# EasyEDA Pro project EasyEDApro.epro

# Schematic IR remote esp32-C6
Create Date: 2024-05-06; Page Name: P1; Project Name: Robonomics_IR_Remote_dev_release; Schematic Name: ESP32-C6-MINI-1; Update Date: 2024-05-21; Company: Robonomics.network; Drawed: ludovich88; Page Size: A4; Part Number: IR-ESP32C6-06-24; Reviewed: EnsRationis; Version: V2.2
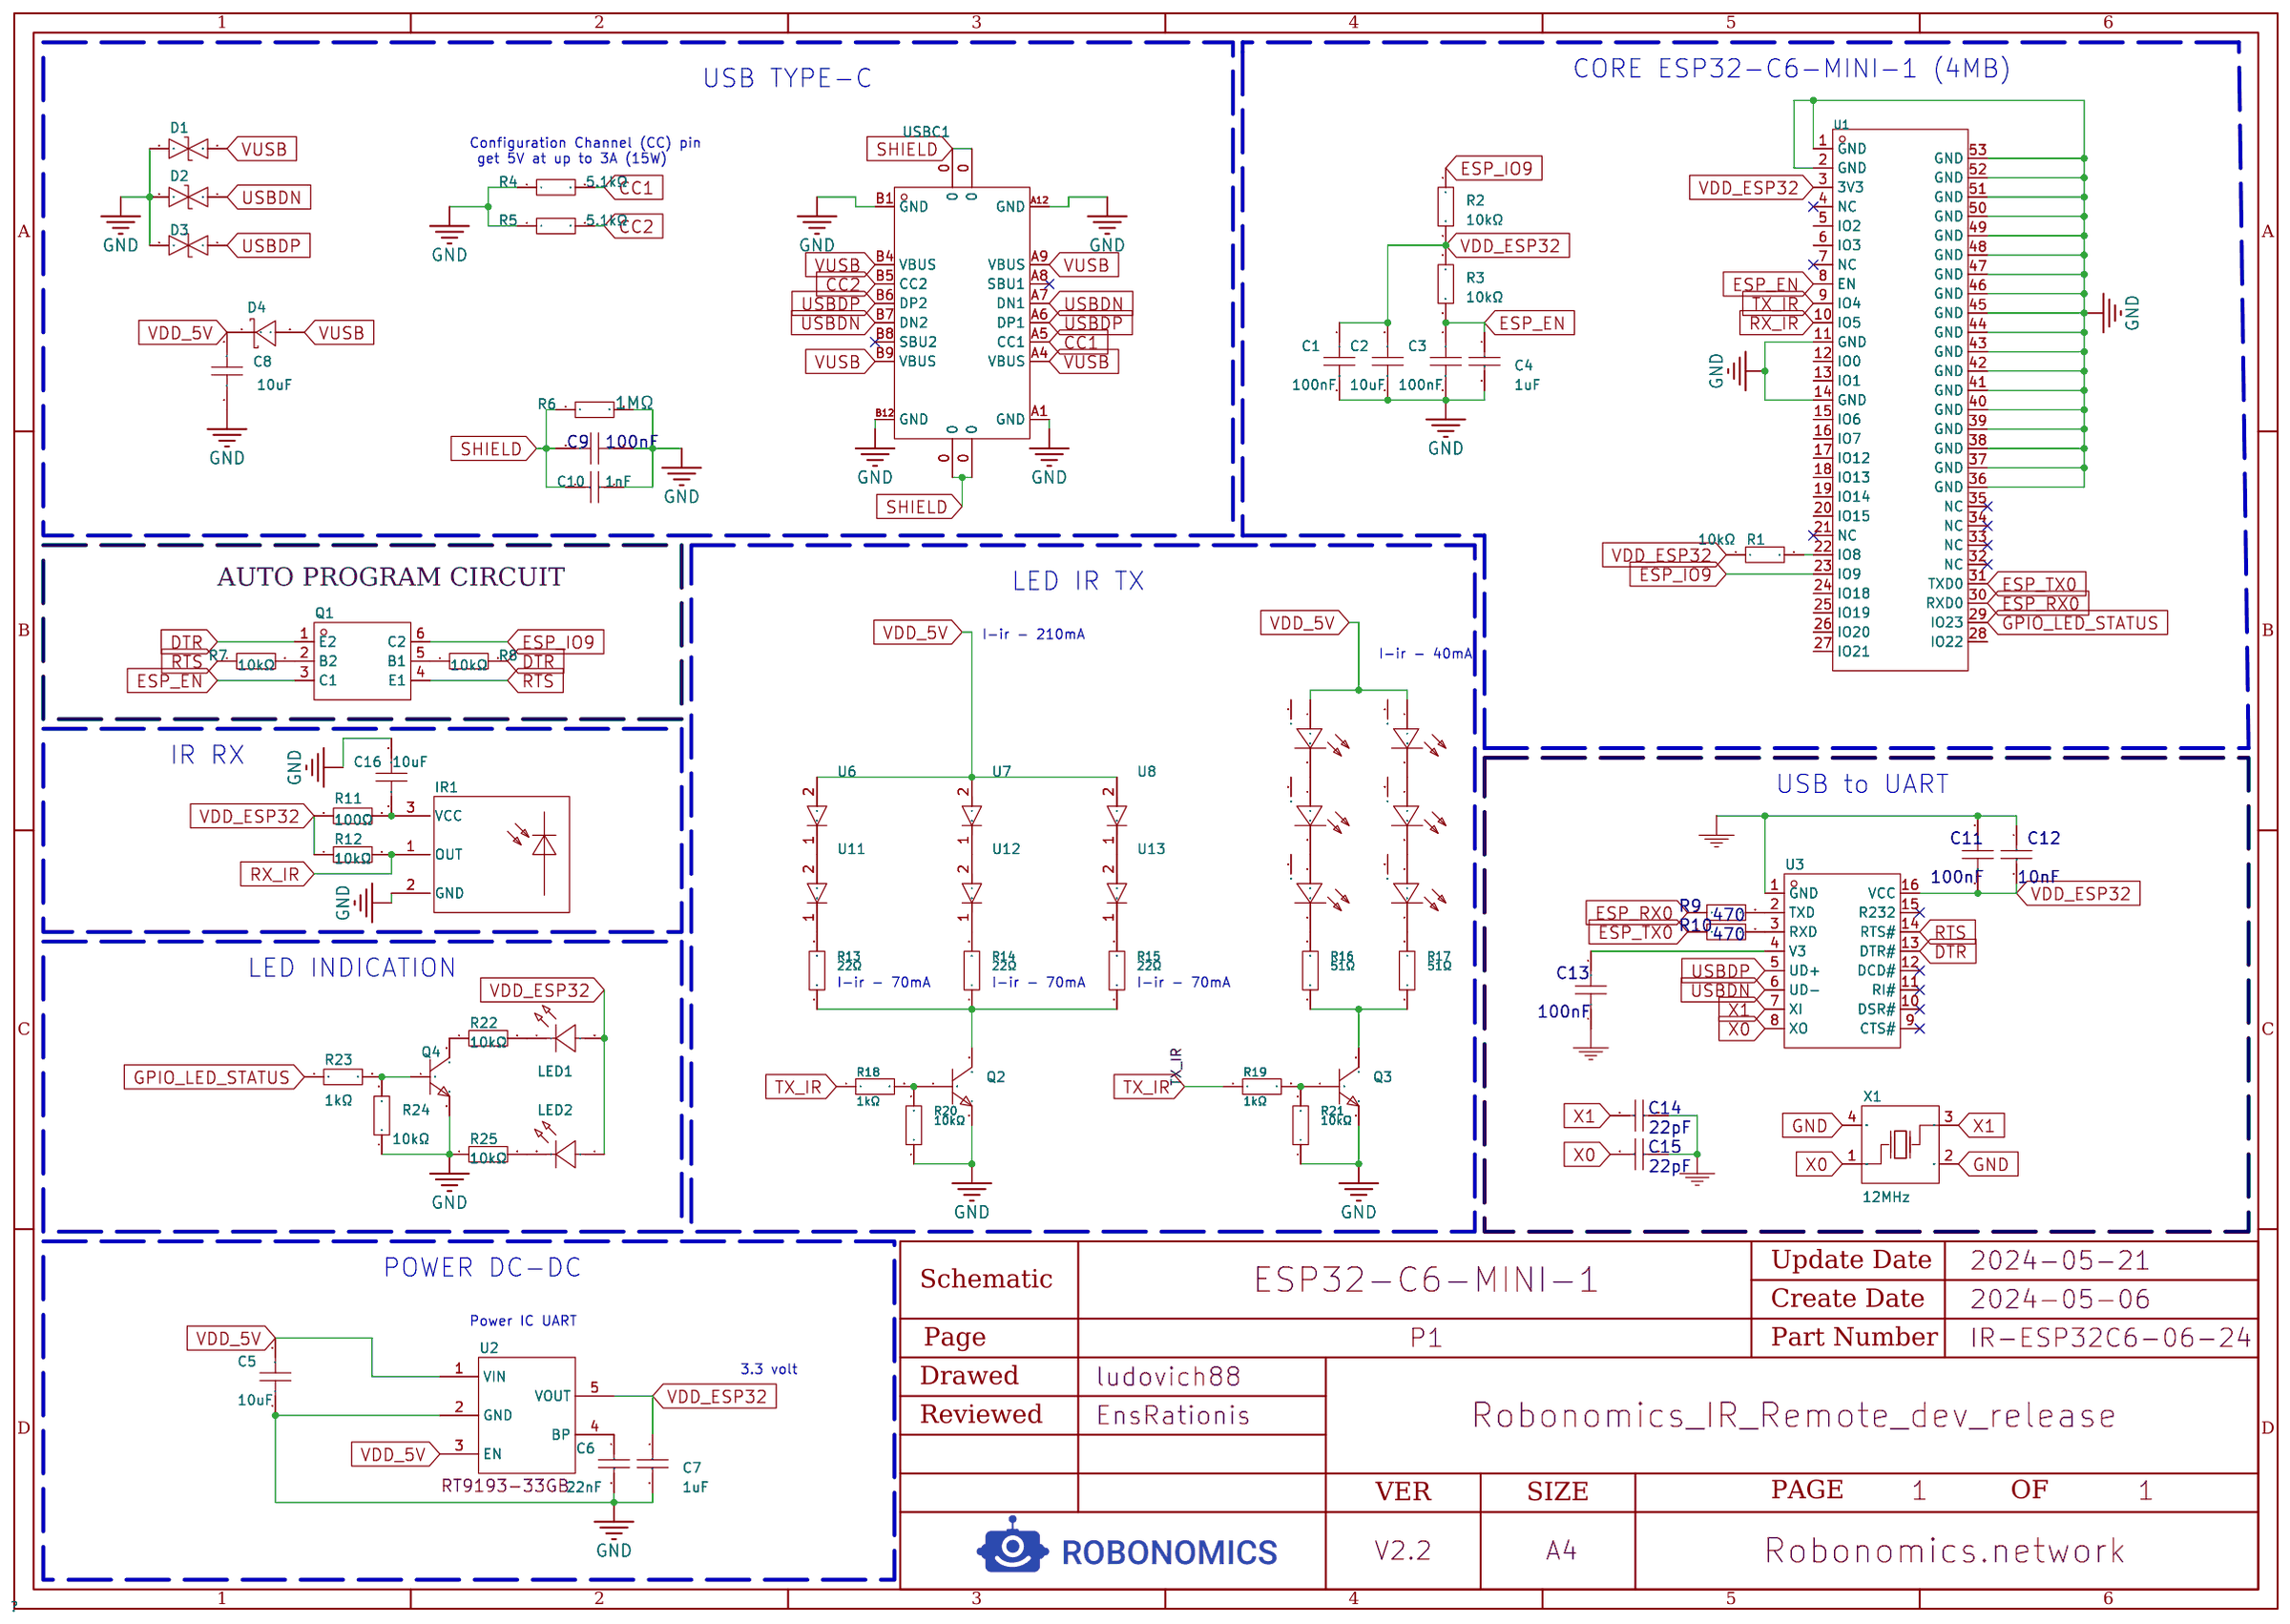
[diagram p0: schematic sheet]

## Parts
C1  100nF  [C0603]
C2  10uF  [C0603]
C3  100nF  [C0603]
C4  1uF  [C0603]
C5  10uF  [C0603]
C6  22nF  [C0603]
C7  1uF  [C0603]
C8  10uF  [C0603]
C9  100nF  [C0603]
C10  1nF  [C0603]
C11  100nF  [C0603]
C12  10nF  [C0603]
C13  100nF  [C0603]
C14  22pF  [C0603]
C15  22pF  [C0603]
C16  10uF  [C0603]
D1  -  [SOD-523_L1.2-W0.8-LS1.6-BI]
D2  -  [SOD-523_L1.2-W0.8-LS1.6-BI]
D3  -  [SOD-523_L1.2-W0.8-LS1.6-BI]
D4  -  [SOD-123_L2.7-W1.6-LS3.7-RD]
IR1  -  [OPTO-TH_IRM-56384]
LED1  XL-4008UGC  [LED-SMD_L4.0-W1.4-RD_GREEN]
LED2  XL-4008SURC  [LED-SMD_L4.0-W1.4-FD_my]
Q1  -  [SOT-363_L2.0-W1.3-P0.65-LS2.1-BR]
Q2  -  [SOT-23-3_L2.9-W1.6-P1.90-LS2.8-BR]
Q3  -  [SOT-23-3_L2.9-W1.6-P1.90-LS2.8-BR]
Q4  SS8050  [SOT-23-3_L2.9-W1.6-P1.90-LS2.8-BR]
R1  10kΩ  [R0603]
R2  10kΩ  [R0603]
R3  10kΩ  [R0603]
R4  5.1kΩ  [R0603]
R5  5.1kΩ  [R0603]
R6  1MΩ  [R0603]
R7  10kΩ  [R0603]
R8  10kΩ  [R0603]
R9  470Ω  [R0603]
R10  470Ω  [R0603]
R11  100Ω  [R0603]
R12  10kΩ  [R0603]
R13  22Ω  [R0603]
R14  22Ω  [R0603]
R15  22Ω  [R0603]
R16  51Ω  [R0603]
R17  51Ω  [R0603]
R18  1kΩ  [R0603]
R19  1kΩ  [R0603]
R20  10kΩ  [R0603]
R21  10kΩ  [R0603]
R22  10kΩ  [R0603]
R23  1kΩ  [R0603]
R24  10kΩ  [R0603]
R25  10kΩ  [R0603]
U1  ESP32-C6-MINI-1-N4  [WIFIM-SMD_61P-L16.6-W13.2-P0.80-ESP32-C6-MINI-1-N4]
U2  -  [SOT-23-5_L3.0-W1.7-P0.95-LS2.8-BR]
U3  -  [SOIC-16_L9.9-W3.9-P1.27-LS6.0-BL]
U4  LKIR30102C-A01(XY)  [LED-SMD_EVERLIGHT_LKIR30102C-A01XY]
U5  LKIR30102C-A01(XY)  [LED-SMD_EVERLIGHT_LKIR30102C-A01XY]
U6  SFH 4253-Z  [OPTO-SMD_L3.2-W2.8-LS3.5-L-1]
U7  SFH 4253-Z  [OPTO-SMD_L3.2-W2.8-LS3.5-L-1]
U8  SFH 4253-Z  [OPTO-SMD_L3.2-W2.8-LS3.5-L-1]
U9  LKIR30102C-A01(XY)  [LED-SMD_EVERLIGHT_LKIR30102C-A01XY]
U10  LKIR30102C-A01(XY)  [LED-SMD_EVERLIGHT_LKIR30102C-A01XY]
U11  SFH 4253-Z  [OPTO-SMD_L3.2-W2.8-LS3.5-L-1]
U12  SFH 4253-Z  [OPTO-SMD_L3.2-W2.8-LS3.5-L-1]
U13  SFH 4253-Z  [OPTO-SMD_L3.2-W2.8-LS3.5-L-1]
U14  LKIR30102C-A01(XY)  [LED-SMD_EVERLIGHT_LKIR30102C-A01XY]
U15  LKIR30102C-A01(XY)  [LED-SMD_EVERLIGHT_LKIR30102C-A01XY]
USBC1  -  [USB-C_SMD-TYPE-C-31-M-12]
X1  12MHz  [OSC-SMD_4P-L3.2-W2.5-BL]

## Library data of the parts
C1 C3 = CC0603KRX7R9BB104: Capacitance: Tolerance:±10% Tolerance:±10% Voltage Rated: Temperature Coefficient:; LCSC Part Name: 100nF ±10% 50V; Supplier Part: C14663; Manufacturer: YAGEO(国巨); Supplier Footprint: 0603; JLCPCB Part Class: Basic Part; Datasheet: https://atta.szlcsc.com/upload/public/pdf/source/20180910/C282072_33301C7F631E79921B82A8DAC6BCC5B3.pdf; Supplier: LCSC; Tolerance: ±10%; Voltage Rated: 50V; Temperature Coefficient: Y5V
C2 C5 C16 = CL10A106KP8NNNC: Capacitance: Tolerance:±10% Tolerance:±10% Voltage Rated: Temperature Coefficient:; LCSC Part Name: 10uF ±10% 10V; Supplier Part: C19702; Manufacturer: SAMSUNG(三星); Supplier Footprint: 0603; JLCPCB Part Class: Basic Part; Datasheet: https://atta.szlcsc.com/upload/public/pdf/source/20160218/1457707763339.pdf; Supplier: LCSC; Tolerance: ±10%; Voltage Rated: 10V; Temperature Coefficient: X5R
C4 C7 = CL10A105KB8NNNC: Capacitance:1uFTolerance:±10%Tolerance:±10%VoltageRated:50VTemperatureCoefficient:X5R; LCSC Part Name: 1uF±10%50V; Supplier Part: C15849; Manufacturer: SAMSUNG(三星); Supplier Footprint: 0603; JLCPCB Part Class: BasicPart; Datasheet: https://atta.szlcsc.com/upload/public/pdf/source/20160103/1457707679084.pdf; Supplier: LCSC; Tolerance: ±10%; Voltage Rated: 50V; Temperature Coefficient: X5R
C6 = CL10B223KB8NNNC: Capacitance:22nFTolerance:±10%Tolerance:±10%VoltageRated:50VTemperatureCoefficient:X7R; LCSC Part Name: 22nF±10%50V; Supplier Part: C21122; Manufacturer: SAMSUNG(三星); Supplier Footprint: 0603; JLCPCB Part Class: BasicPart; Datasheet: https://atta.szlcsc.com/upload/public/pdf/source/20160103/1457707705232.pdf; Supplier: LCSC; Tolerance: ±10%; Voltage Rated: 50V; Temperature Coefficient: X7R
C8 = CL10A106KP8NNNC: Capacitance: Tolerance:±10% Tolerance:±10% Voltage Rated: Temperature Coefficient:; LCSC Part Name: 10uF ±10% 10V; Supplier Part: C19702; Manufacturer: SAMSUNG(三星); Supplier Footprint: 0603; JLCPCB Part Class: Basic Part; Datasheet: https://atta.szlcsc.com/upload/public/pdf/source/20160218/1457707763339.pdf; Supplier: LCSC; Tolerance: ±10%
C9 C11 C13 = CC0603KRX7R9BB104: Capacitance: Tolerance:±10% Tolerance:±10% Voltage Rated: Temperature Coefficient:; LCSC Part Name: 100nF ±10% 50V; Supplier Part: C14663; Manufacturer: YAGEO(国巨); Supplier Footprint: 0603; JLCPCB Part Class: Basic Part; Datasheet: https://atta.szlcsc.com/upload/public/pdf/source/20180910/C282072_33301C7F631E79921B82A8DAC6BCC5B3.pdf; Supplier: LCSC; Tolerance: ±10%
C10 = CL10B102KB8NNNC: Capacitance:1nFTolerance:±10%Tolerance:±10%VoltageRated:50VTemperatureCoefficient:X7R; LCSC Part Name: 1nF±10%50V; Supplier Part: C1588; Manufacturer: SAMSUNG(三星); Supplier Footprint: 0603; JLCPCB Part Class: BasicPart; Datasheet: https://atta.szlcsc.com/upload/public/pdf/source/20160103/1457707679526.pdf; Supplier: LCSC; Tolerance: ±10%; Voltage Rated: 50V; Temperature Coefficient: X7R
C12 = 0603B103K500NT: Supplier: LCSC; Manufacturer: FH; Supplier Part: C57112; JLCPCB Part Class: BasicPart
C14 C15 = CL10C220JB8NNNC: Supplier: LCSC; Manufacturer: SAMSUNG; Supplier Part: C1653; JLCPCB Part Class: BasicPart
D1-D3 = LESD5D5.0CT1G: Polarity:Bi-DirectionalReverseStand-OffVoltage(Vrwm):5VBreakdownVoltage(VBR):5.6VPeakPulseCurrent(Ipp)@8/20us:9.4AClampingVoltage@Ipp:18.6V; Supplier Part: C383211; Manufacturer: LRC(乐山无线电); Supplier Footprint: SOD-523; JLCPCB Part Class: ExtendedPart; Datasheet: https://atta.szlcsc.com/upload/public/pdf/source/20190807/C383211_633DF4B4E2C161403226E5235FE33A1C.pdf; Supplier: LCSC; Polarity: Bi-Directional; Reverse Stand-Off Voltage (Vrwm): 5V; Breakdown Voltage (VBR): 5.6V; Peak Pulse Current(Ipp)@8/20us: 9.4A; Clamping Voltage@Ipp: 18.6V
D4 = 1N5819HW-7-F: ReverseVoltage(Vr):40VAverageRectifiedCurrent(Io):1AForwardVoltage(Vf@If):450mV@1A; LCSC Part Name: 40V1A450mV@1A; Supplier Part: C82544; Manufacturer: DIODES(美台); Supplier Footprint: SOD-123; JLCPCB Part Class: ExtendedPart; Datasheet: https://atta.szlcsc.com/upload/public/pdf/source/20161024/1477288459223.pdf; Supplier: LCSC; Reverse Voltage (Vr): 40V; Average Rectified Current (Io): 1A; Forward Voltage (Vf@If): 450mV@1A
IR1 = IRM-56384: Supplier Part: C72048; Manufacturer: EVERLIGHT(亿光); Supplier Footprint: SIP-3-2.54mm; Datasheet: https://atta.szlcsc.com/upload/public/pdf/source/20160507/1462613614000.pdf; Supplier: LCSC
LED1 = XL-4008UGC: EmittedColor:EmeraldLensColor:ColorlesstransparenceDominantWavelength:520nm~525nmDominantWavelength:520nm~525nmPeakWavelength:525nmForwardCurrent:50mAPowerDissipation:125mWViewingAngle:120°MountingSytle:SidestickersOperatingTemperatur; LCSC Part Name: 侧贴; Supplier Part: C2843772; Manufacturer: XINGLIGHT(成兴光); Supplier Footprint: SMD,1.4x4mm; JLCPCB Part Class: ExtendedPart; Datasheet: https://atta.szlcsc.com/upload/public/pdf/source/20221102/5120FC94C7C2123DB0544AD5FB85956A.pdf; Supplier: LCSC; Emitted Color: Emerald; Lens Color: Colorlesstransparence; Dominant Wavelength: 520nm~525nm; Peak Wavelength: 525nm; Forward Current: 50mA; Power Dissipation: 125mW; Viewing Angle: 120°; Mounting Sytle: Sidestickers; Operating Temperature: -30℃~+85℃
LED2 = XL-4008SURC: EmittedColor:红灯LensColor:ColorlesstransparenceDominantWavelength:620nm~625nmDominantWavelength:620nm~625nmPeakWavelength:625nmForwardCurrent:50mAPowerDissipation:125mWViewingAngle:120°MountingSytle:SidestickersOperatingTemperature:-30; LCSC Part Name: 红灯侧贴; Supplier Part: C2843771; Manufacturer: XINGLIGHT(成兴光); Supplier Footprint: SMD,1.4x4mm; JLCPCB Part Class: ExtendedPart; Datasheet: https://atta.szlcsc.com/upload/public/pdf/source/20221102/EAC0B38F8924C881A99BE374D0B10640.pdf; Supplier: LCSC; Emitted Color: 红灯; Lens Color: Colorlesstransparence; Dominant Wavelength: 620nm~625nm; Peak Wavelength: 625nm; Forward Current: 50mA; Power Dissipation: 125mW; Viewing Angle: 120°; Mounting Sytle: Sidestickers; Operating Temperature: -30℃~+85℃
Q1 = LBC847BDW1T1G: TransistorType:2NPNCollector-EmitterBreakdownVoltage(Vceo):CollectorCurrent(Ic):PowerDissipation(Pd):CollectorCut-OffCurrent(Icbo):15nACollector-EmitterSaturationVoltage(VCE(sat)@Ic,Ib):600mV@100mA,5mADCCurrentGain(hFE@Ic,Vce):180@; LCSC Part Name: 2个NPN45V100mA; Supplier Part: C383191; Manufacturer: LRC(乐山无线电); Supplier Footprint: SC-88; Datasheet: https://atta.szlcsc.com/upload/public/pdf/source/20190725/C383191_905ABB7983ACCB470816CB967A06AF18.pdf; Supplier: LCSC; Transistor Type: 2NPN; Collector Cut-Off Current (Icbo): 15nA; Collector-Emitter Saturation Voltage (VCE(sat)@Ic,Ib): 600mV@100mA,5mA; DC Current Gain (hFE@Ic,Vce): 180@2mA,5V; Transition Frequency (fT): 100MHz; Operating Temperature: -55℃~+150℃@(Tj)
Q2 Q3 = SS8050_C177739: TransistorType:Collector-EmitterBreakdownVoltage(Vceo):CollectorCurrent(Ic):PowerDissipation(Pd):CollectorCut-OffCurrent(Icbo):100nACollector-EmitterSaturationVoltage(VCE(sat)@Ic,Ib):500mV@800mA,80mADCCurrentGain(hFE@Ic,Vce):300@100; LCSC Part Name: NPN25V1.5AJ档300-400; Supplier Part: C177739; Manufacturer: CJ(江苏长电/长晶); Manufacturer Part: SS8050; Supplier Footprint: SOT-23; Datasheet: https://atta.szlcsc.com/upload/public/pdf/source/20180130/C177739_15172974524031323483.pdf; Supplier: LCSC; Collector Cut-Off Current (Icbo): 100nA; Collector-Emitter Saturation Voltage (VCE(sat)@Ic,Ib): 500mV@800mA,80mA; DC Current Gain (hFE@Ic,Vce): 300@100mA,1V; Transition Frequency (fT): 100MHz; Operating Temperature: +150℃@(Tj)
Q4 = SS8050_C181160: TransistorType:Collector-EmitterBreakdownVoltage(Vceo):CollectorCurrent(Ic):PowerDissipation(Pd):CollectorCut-OffCurrent(Icbo):100nACollector-EmitterSaturationVoltage(VCE(sat)@Ic,Ib):500mV@800mA,80mADCCurrentGain(hFE@Ic,Vce):200@100; LCSC Part Name: NPN25V1.5AH档（200-350）; Supplier Part: C181160; Manufacturer: Hottech(合科泰); Supplier Footprint: SOT-23; JLCPCB Part Class: ExtendedPart; Datasheet: https://atta.szlcsc.com/upload/public/pdf/source/20220506/87BBA77FEE9CB4B19031AE933C67329E.pdf; Supplier: LCSC; Collector Cut-Off Current (Icbo): 100nA; Collector-Emitter Saturation Voltage (VCE(sat)@Ic,Ib): 500mV@800mA,80mA; DC Current Gain (hFE@Ic,Vce): 200@100mA,1V; Transition Frequency (fT): 100MHz; Operating Temperature: +150℃@(Tj)
R1-R3 R7 R8 R12 R22 R24 R25 = 0603WAF1002T5E: Type:Thick Film Resistors Resistance:10000Ω Tolerance:±1% Tolerance:±1% Power(Watts): Overload Voltage (Max): Temperature Coefficient:±100ppm/℃ Temperature Coefficient:±100ppm/℃ Operating Temperature Range:-55℃~+155℃ Operating Temperature Range:-55℃~+155℃; LCSC Part Name: 10kΩ ±1% 100mW 厚膜电阻; Supplier Part: C25804; Manufacturer: UNI-ROYAL(厚声); Supplier Footprint: 0603; JLCPCB Part Class: Basic Part; Datasheet: https://atta.szlcsc.com/upload/public/pdf/source/20200306/C422600_1E6D84923E4A46A82E41ADD87F860B5C.pdf; Supplier: LCSC; Tolerance: ±1%; Power(Watts): 1/10W; Overload Voltage (Max): 75V; Temperature Coefficient: ±100ppm/℃; Type: Thick Film Resistors; Operating Temperature Range: -55℃~+155℃
R4 R5 = 0603WAF5101T5E: Type:厚膜电阻 Resistance:5.1kΩ Tolerance:±1% Power(Watts):1/10W Temperature Coefficient:±100ppm/ Temperature Coefficient:±100ppm/ Overload Voltage (Max):75V Operating Temperature Range:-55~+155 Operating Temperature Range:-55~+155; LCSC Part Name: 5.1kΩ±1%; Supplier Part: C23186; Manufacturer: UNI-ROYAL(厚声); Supplier Footprint: 0603; JLCPCB Part Class: BasicPart; Datasheet: https://atta.szlcsc.com/upload/public/pdf/source/20200306/C422600_1E6D84923E4A46A82E41ADD87F860B5C.pdf; Supplier: LCSC; Type: 厚膜电阻; Tolerance: ±1%; Power(Watts): 1/10W; Temperature Coefficient: ±100ppm/; Overload Voltage (Max): 75V; Operating Temperature Range: -55~+155
R6 = 0603WAF1004T5E: LCSC Part Name: 1MΩ(1004)±1%编带; Supplier Part: C22935; Manufacturer: UNI-ROYAL(厚声); Supplier Footprint: 0603; JLCPCB Part Class: BasicPart; Datasheet: https://atta.szlcsc.com/upload/public/pdf/source/20170920/C22935_1505900992858982324.pdf; Supplier: LCSC
R9 R10 = 0603WAF4700T5E: Supplier: LCSC; Manufacturer: UniOhm; Supplier Part: C23179; JLCPCB Part Class: BasicPart
R11 = 0603WAF1000T5E: Type:ThickFilmResistorsResistance:Tolerance:±1%Tolerance:±1%Power(Watts):TemperatureCoefficient:±200ppm/℃TemperatureCoefficient:±200ppm/℃OverloadVoltage(Max):OperatingTemperatureRange:-55℃~+155℃OperatingTemperatureRange:-55℃~+155℃; LCSC Part Name: 100Ω±1%100mW; Supplier Part: C22775; Manufacturer: UNI-ROYAL(厚声); Supplier Footprint: 0603; JLCPCB Part Class: BasicPart; Datasheet: https://atta.szlcsc.com/upload/public/pdf/source/20200306/C422600_1E6D84923E4A46A82E41ADD87F860B5C.pdf; Supplier: LCSC; Type: ThickFilmResistors; Tolerance: ±1%; Temperature Coefficient: ±200ppm/℃; Operating Temperature Range: -55℃~+155℃
R13-R15 = 0603WAF220JT5E: Type:Thick Film Resistors Resistance:22Ω Tolerance:±1% Tolerance:±1% Power(Watts): Overload Voltage (Max): Temperature Coefficient:±100ppm/℃ Temperature Coefficient:±100ppm/℃ Operating Temperature Range:-55℃~+155℃ Operating Temperature Range:-55℃~+155℃; LCSC Part Name: 22Ω ±1% 100mW 厚膜电阻; Supplier Part: C23345; Manufacturer: UNI-ROYAL(厚声); Supplier Footprint: 0603; JLCPCB Part Class: Basic Part; Datasheet: https://atta.szlcsc.com/upload/public/pdf/source/20200306/C422600_1E6D84923E4A46A82E41ADD87F860B5C.pdf; Supplier: LCSC; Type: Thick Film Resistors; Tolerance: ±1%; Temperature Coefficient: ±100ppm/℃; Operating Temperature Range: -55℃~+155℃
R16 R17 = 0603WAF510JT5E: Resistance:51000mΩ Tolerance:±1% Tolerance:±1% Power(Watts): Overload Voltage (Max): Temperature Coefficient:±100ppm/℃ Temperature Coefficient:±100ppm/℃ Type:Thick Film Resistors Operating Temperature Range:-55℃~+155℃ Operating Temperature Range:-55℃~+155; LCSC Part Name: 51Ω ±1% 100mW 厚膜电阻; Supplier Part: C23197; Manufacturer: UNI-ROYAL(厚声); Supplier Footprint: 0603; JLCPCB Part Class: Basic Part; Datasheet: https://atta.szlcsc.com/upload/public/pdf/source/20200306/C422600_1E6D84923E4A46A82E41ADD87F860B5C.pdf; Supplier: LCSC; Tolerance: ±1%; Temperature Coefficient: ±100ppm/℃; Type: Thick Film Resistors; Operating Temperature Range: -55℃~+155℃
R18 R19 = 0603WAF1001T5E: Type:Thick Film Resistors Resistance: Tolerance:±1% Tolerance:±1% Power(Watts): Temperature Coefficient:±100ppm/℃ Temperature Coefficient:±100ppm/℃ Overload Voltage (Max): Operating Temperature Range:-55℃~+155℃ Operating Temperature Range:-55℃~+155℃; LCSC Part Name: 厚膜电阻 1kΩ ±1% 100mW; Supplier Part: C21190; Manufacturer: UNI-ROYAL(厚声); Supplier Footprint: 0603; JLCPCB Part Class: Basic Part; Datasheet: https://atta.szlcsc.com/upload/public/pdf/source/20200306/C422600_1E6D84923E4A46A82E41ADD87F860B5C.pdf; Supplier: LCSC; Type: Thick Film Resistors; Tolerance: ±1%; Temperature Coefficient: ±100ppm/℃; Operating Temperature Range: -55℃~+155℃
R20 R21 = 0603WAF1002T5E: Type:Thick Film Resistors Resistance:10000Ω Tolerance:±1% Tolerance:±1% Power(Watts): Overload Voltage (Max): Temperature Coefficient:±100ppm/℃ Temperature Coefficient:±100ppm/℃ Operating Temperature Range:-55℃~+155℃ Operating Temperature Range:-55℃~+155℃; LCSC Part Name: 10kΩ ±1% 100mW 厚膜电阻; Supplier Part: C25804; Manufacturer: UNI-ROYAL(厚声); Supplier Footprint: 0603; JLCPCB Part Class: Basic Part; Datasheet: https://atta.szlcsc.com/upload/public/pdf/source/20200306/C422600_1E6D84923E4A46A82E41ADD87F860B5C.pdf; Supplier: LCSC; Tolerance: ±1%; Temperature Coefficient: ±100ppm/℃; Type: Thick Film Resistors; Operating Temperature Range: -55℃~+155℃
R23 = RC0603FR-071KL: Resistance:Tolerance:±1%Tolerance:±1%Power(Watts):TemperatureCoefficient:±100ppm/℃TemperatureCoefficient:±100ppm/℃OverloadVoltage(Max):OperatingTemperatureRange:-55℃~+155℃OperatingTemperatureRange:-55℃~+155℃; LCSC Part Name: 1kΩ±1%100mW; Supplier Part: C22548; Manufacturer: YAGEO(国巨); Supplier Footprint: 0603; JLCPCB Part Class: ExtendedPart; Datasheet: https://atta.szlcsc.com/upload/public/pdf/source/20180312/7BD3618A8B6324EA6280B0497A051AB7.pdf; Supplier: LCSC; Tolerance: ±1%; Temperature Coefficient: ±100ppm/℃; Operating Temperature Range: -55℃~+155℃
U1 = ESP32-C6-MINI-1-N4: Supplier Part: C5736265; Manufacturer: ESPRESSIF(乐鑫); Supplier Footprint: SMD-53P; JLCPCB Part Class: Extended Part; Datasheet: https://atta.szlcsc.com/upload/public/pdf/source/20240130/4529D418EFEC832950EB8101798FAED6.pdf; Supplier: LCSC
U2 = RT9193-33GB: OutputType:固定OutputPolarity:正NumberofOutputs:1MaximumInputVoltage:5.5VOutputVoltage:3.3VOutputVoltage:3.3VDropoutVoltage:300mV@(300mA)OutputCurrent:300mAPowerSupplyRejectionRatio(PRSS):70dB@(100Hz),50dB@(10kHz); LCSC Part Name: Vin=5.5VVout=3.3V300mA70dB@(100Hz),50dB@(10kHz); Supplier Part: C15651; Manufacturer: RICHTEK(台湾立锜); Supplier Footprint: SOT-23-5; JLCPCB Part Class: ExtendedPart; Datasheet: https://atta.szlcsc.com/upload/public/pdf/source/20130730/1457706628575.pdf; Supplier: LCSC; Output Type: 固定; Output Polarity: 正; Number of Outputs: 1; Maximum Input Voltage: 5.5V; Output Voltage: 3.3V; Dropout Voltage: 300mV@(300mA); Output Current: 300mA; Power Supply Rejection Ratio (PRSS): 70dB@(100Hz),50dB@(10kHz)
U3 = CH340G: Type:TransceiverProtocol:USB2.0NumberofDrivers/Receivers:-DataRate:2MbpsSupplyVoltage:3.3V,5V; Supplier Part: C14267; Manufacturer: WCH(南京沁恒); Supplier Footprint: SOP-16_150mil; JLCPCB Part Class: ExtendedPart; Datasheet: https://atta.szlcsc.com/upload/public/pdf/source/20200819/C14267_9F0B4B8160AEBA86F3219E64956E4601.pdf; Supplier: LCSC; Type: Transceiver; Protocol: USB2.0; Data Rate: 2Mbps; Supply Voltage: 3.3V,5V
U4 U5 U9 U10 U14 U15 = LKIR30102C-A01(XY): Supplier Part: C2874187; Manufacturer: EVERLIGHT(亿光); Supplier Footprint: SMD-3P,2x3mm; JLCPCB Part Class: Extended Part; Datasheet: https://atta.szlcsc.com/upload/public/pdf/source/20210803/C2874187_E8BC3F3987A1EDC6242A0C232E3AD98B.pdf; Supplier: LCSC
U6-U8 U11-U13 = SFH 4253-Z: Vf - Forward Voltage:1.6V Vf - Forward Voltage:1.6V Wavelength:860nm Wavelength:860nm Radiant Intensity:6.3mW/sr@70mA View Angle:120° Operating Temperature:-40℃~+100℃ Operating Temperature:-40℃~+100℃; LCSC Part Name: 光电二极管; Supplier Part: C2900339; Manufacturer: OSRAM(欧司朗); Supplier Footprint: SMD; JLCPCB Part Class: Extended Part; Datasheet: https://atta.szlcsc.com/upload/public/pdf/source/20210702/C2765347_A31CFC617678E8698ED6795D9701EB7D.pdf; Supplier: LCSC; Vf - Forward Voltage: 1.6V; Wavelength: 860nm; Radiant Intensity: 6.3mW/sr@70mA; View Angle: 120°; Operating Temperature: -40℃~+100℃
USBC1 = TYPE-C-31-M-12: ConnectorType:Type-CStandard:-Gender:母座NumberofContacts:16NumberofPorts:1CurrentRating-Power(Max):250mA; Supplier Part: C165948; Manufacturer: 韩国韩荣; JLCPCB Part Class: ExtendedPart; Datasheet: https://atta.szlcsc.com/upload/public/pdf/source/20210111/C2682493_D8CCFED08835E878D16ACCF4460E43B8.pdf; Supplier: LCSC; Connector Type: Type-C; Gender: 母座; Number of Contacts: 16; Number of Ports: 1; Current Rating - Power (Max): 250mA
X1 = X322512MSB4SI: Crystal Type:贴片无源晶振 Frequency:12MHz Frequency Tolerance:±10ppm Frequency Tolerance:±10ppm Frequency Stability:±30ppm Frequency Stability:±30ppm Load Capacitance:20pF Operating Temperature:-40~+85 Operating Temperature:-40~+85; LCSC Part Name: 12MHz±10ppm20pF; Supplier Part: C9002; Manufacturer: YXC扬兴科技; Supplier Footprint: SMD3225-4P; JLCPCB Part Class: BasicPart; Datasheet: https://atta.szlcsc.com/upload/public/pdf/source/20210329/C112971_1F611BDC486E193C1706F6D8EB5AA189.pdf; Supplier: LCSC; Crystal Type: 贴片无源晶振; Frequency Tolerance: ±10ppm; Frequency Stability: ±30ppm; Load Capacitance: 20pF; Operating Temperature: -40~+85

## Nets
GND: C1.2 C2.1 C3.2 C4.2 C5.1 C6.2 C7.2 C8.1 C9.1 C10.2 C11.1 C12.1 C13.1 C14.1 C15.1 C16.2 D1.2 D2.2 D3.2 IR1.2(GND) Q2.2(E) Q3.2(E) Q4.2(E) R4.1 R5.1 R6.2 R20.1 R21.1 R24.1 R25.1 U1.1(GND) U1.2(GND) U1.11(GND) U1.14(GND) U1.36(GND) U1.37(GND) U1.38(GND) U1.39(GND) U1.40(GND) U1.41(GND) U1.42(GND) U1.43(GND) U1.44(GND) U1.45(GND) U1.46(GND) U1.47(GND) U1.48(GND) U1.49(GND) U1.50(GND) U1.51(GND) U1.52(GND) U1.53(GND) U2.2(GND) U3.1(GND) USBC1.A1(GND) USBC1.A12(GND) USBC1.B1(GND) USBC1.B12(GND) X1.2(GND) X1.4(GND)
VDD_5V: C5.2 C8.2 D4.1(K) U2.1(VIN) U2.3(EN) U4.1(A) U5.1(A) U6.2(A) U7.2(A) U8.2(A)
VDD_ESP32: C1.1 C2.2 C7.1 C11.2 C12.2 LED1.2(A) LED2.1(A) R1.1 R2.2 R3.1 R11.1 R12.1 U1.3(3V3) U2.5(VOUT) U3.16(VCC)
CC1: R4.2 USBC1.A5(CC1)
CC2: R5.2 USBC1.B5(CC2)
DTR: Q1.1(E2) R8.2 U3.13(DTR#)
ESP_EN: C3.1 C4.1 Q1.3(C1) R3.2 U1.8(EN)
ESP_IO9: Q1.6(C2) R2.1 U1.23(IO9)
ESP_RX0: R9.1 U1.30(RXD0)
ESP_TX0: R10.1 U1.31(TXD0)
GPIO_LED_STATUS: R23.1 U1.29(IO23)
RTS: Q1.4(E1) R7.1 U3.14(RTS#)
RX_IR: IR1.1(OUT) R12.2 U1.10(IO5)
SHIELD: C9.2 C10.1 R6.1 USBC1.0
TX_IR: R18.1 R19.1 U1.9(IO4)
USBDN: D2.1 U3.6(UD-) USBC1.A7(DN1) USBC1.B7(DN2)
USBDP: D3.1 U3.5(UD+) USBC1.A6(DP1) USBC1.B6(DP2)
VUSB: D1.1 D4.2(A) USBC1.A4(VBUS) USBC1.A9(VBUS) USBC1.B4(VBUS) USBC1.B9(VBUS)
X0: C15.2 U3.8(XO) X1.1(OSC1)
X1: C14.2 U3.7(XI) X1.3(OSC2)
Net-(C6-1): C6.1 U2.4(BP)
Net-(C13-2): C13.2 U3.4(V3)
Net-(C16-1): C16.1 IR1.3(VCC) R11.2
Net-(LED1-1): LED1.1(K) R22.2
Net-(LED2-2): LED2.2(K) R25.2
Net-(Q1-2): Q1.2(B2) R7.2
Net-(Q1-5): Q1.5(B1) R8.1
Net-(Q2-1): Q2.1(B) R18.2 R20.2
Net-(Q2-3): Q2.3(C) R13.1 R14.1 R15.1
Net-(Q3-1): Q3.1(B) R19.2 R21.2
Net-(Q3-3): Q3.3(C) R16.1 R17.1
Net-(Q4-1): Q4.1(B) R23.2 R24.2
Net-(Q4-3): Q4.3(C) R22.1
Net-(R1-2): R1.2 U1.22(IO8)
Net-(R9-2): R9.2 U3.2(TXD)
Net-(R10-2): R10.2 U3.3(RXD)
Net-(R13-2): R13.2 U11.1(C)
Net-(R14-2): R14.2 U12.1(C)
Net-(R15-2): R15.2 U13.1(C)
Net-(R16-2): R16.2 U14.2(C)
Net-(R17-2): R17.2 U15.2(C)
Net-(U4-2): U4.2(C) U9.1(A)
Net-(U5-2): U5.2(C) U10.1(A)
Net-(U6-1): U6.1(C) U11.2(A)
Net-(U7-1): U7.1(C) U12.2(A)
Net-(U8-1): U8.1(C) U13.2(A)
Net-(U9-2): U9.2(C) U14.1(A)
Net-(U10-2): U10.2(C) U15.1(A)

Not connected (* = marked no-connect by the designer): U1 4(NC)* 5(IO2) 6(IO3) 7(NC)* 12(IO0) 13(IO1) 15(IO6) 16(IO7) 17(IO12) 18(IO13) 19(IO14) 20(IO15) 21(NC)* 24(IO18) 25(IO19) 26(IO20) 27(IO21) 28(IO22) 32(NC)* 33(NC)* 34(NC)* 35(NC)*; U3 9(CTS#)* 10(DSR#)* 11(RI#)* 12(DCD#)* 15(R232)*; U4 3; U5 3; U9 3; U10 3; U14 3; U15 3; USBC1 A8(SBU1)* B8(SBU2)*

## Notes on the sheet
- USB TYPE-C
- CORE ESP32-C6-MINI-1 (4MB)
- Configuration Channel (CC) pin
   get 5V at up to 3A (15W)
- AUTO PROGRAM CIRCUIT
- LED IR TX
- I-ir - 210mA
- I-ir - 40mA
- IR RX
- USB to UART
- LED INDICATION
- I-ir - 70mA
- I-ir - 70mA
- I-ir - 70mA
- POWER DC-DC
- Power IC UART
- 3.3 volt

# Board IR remote esp32-C6
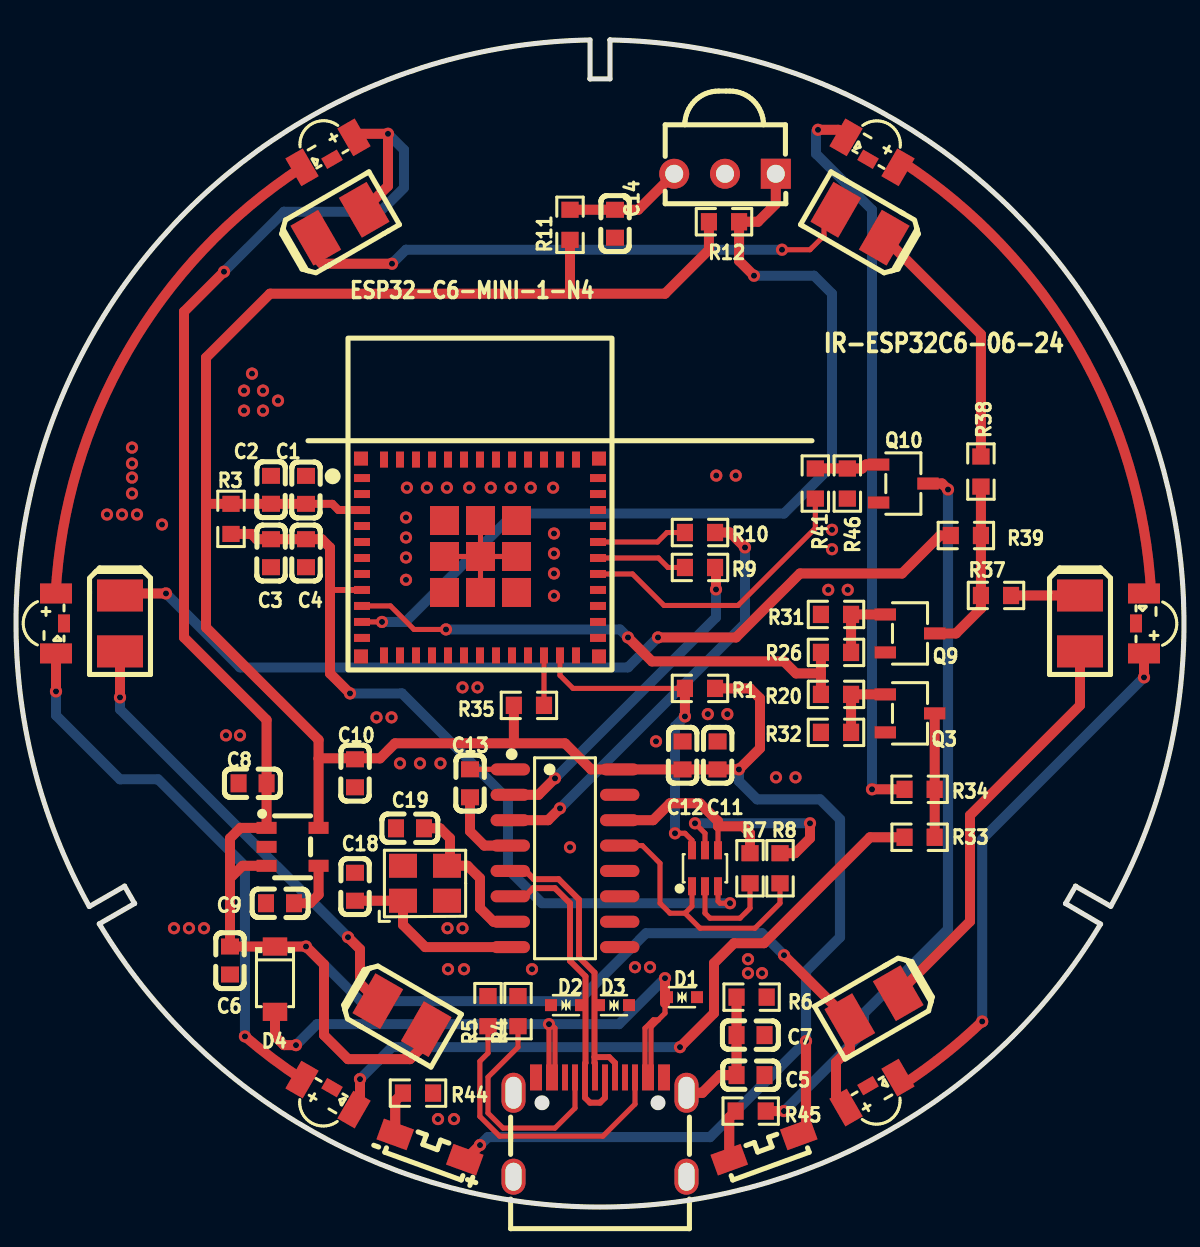
[diagram p1: board, top side]
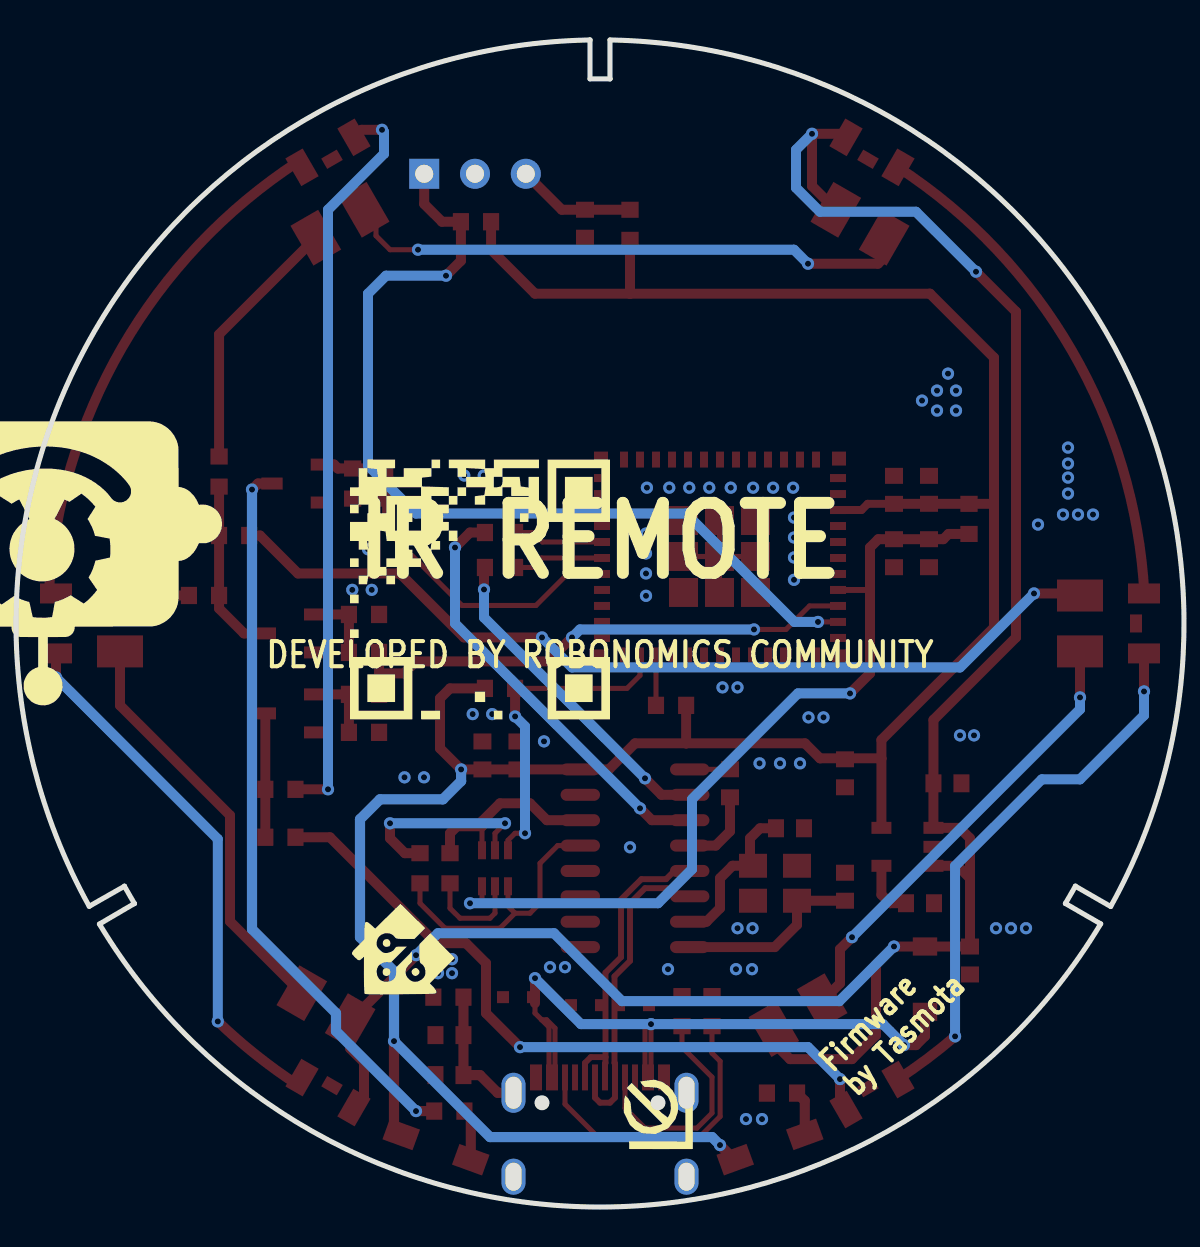
[diagram p2: board, bottom side, seen from below]

Outline 58.4 x 58.4 mm; copper layers: Top Layer, Bottom Layer. Coordinates in mm from the lower left corner of the outline.
Outline path: 3.67,15.04 5.43,16.05 5.93,15.19 4.17,14.17 arc(29.2,0) 54.23,14.16 52.48,15.18 52.48,15.18 52.98,16.05 54.74,15.05 arc(54.49,43.81) 29.7,58.4 29.7,56.45 28.7,56.45 28.71,56.45 28.71,58.4 arc(3.92,43.8) 3.67,15.04
Stack: Top Layer 0.035mm / Dielectric1 1.51mm FR4 er 4.5 / Bottom Layer 0.035mm

## Design rules (mm)
net USBDP: DP1
net USBDN: DP1
template: User Custom Config
spacing safeClearance (default): track to track 0.152, other pairs 0.152 to 0.3
track width trackWidth (default): min 0.127, default 0.254, max 2.54
differential pair differentialPair (default): width min 0.127, default 0.254, max 2.54; gap min 0.152, default 0.152
differential pair jlcpcb_2l_z90_copl: width min 0.254, default 0.297, max 2.54; gap min 0.152, default 0.152
via viaSize (default): diameter min 0.5, default 0.61, max 10; hole min 0.3, default 0.305, max 5.999
net GND uses copperRegion_USB
net USBDP uses copperRegion_USB, jlcpcb_2l_z90_copl
net USBDN uses copperRegion_USB, jlcpcb_2l_z90_copl
diff pair DP1 uses jlcpcb_2l_z90_copl

## Placement (name value [footprint] x y rotation side)
C1  100nF  [C0603]  14.51 35.89 90 top
C2  10uF  [C0603]  12.76 35.89 270 top
C3  100nF  [C0603]  12.76 32.72 270 top
C4  1uF  [C0603]  14.51 32.72 270 top
C5  10uF  [C0603]  36.73 6.6 180 top
C6  22nF  [C0603]  10.7 12.34 90 top
C7  1uF  [C0603]  36.73 8.6 0 top
C8  10uF  [C0603]  11.83 21.2 0 top
C9  100nF  [C0603]  13.2 15.2 180 top
C10  1nF  [C0603]  16.95 21.7 270 top
C11  100nF  [C0603]  35.08 22.6 270 top
C12  10nF  [C0603]  33.33 22.6 270 top
C13  100nF  [C0603]  22.7 21.2 270 top
C14  22pF  [C0603]  29.95 49.2 270 top
C18  22pF  [C0603]  16.95 16.03 270 top
C19  22pF  [C0603]  19.7 18.95 0 top
D1  -  [SOD-523_L1.2-W0.8-LS1.6-BI]  33.3 10.5 0 top
D2  -  [SOD-523_L1.2-W0.8-LS1.6-BI]  27.51 10.1 180 top
D3  -  [SOD-523_L1.2-W0.8-LS1.6-BI]  29.9 10.1 0 top
D4  -  [SOD-123_L2.7-W1.6-LS3.7-RD]  12.95 11.4 270 top
IR1  -  [OPTO-TH_IRM-56384]  35.45 51.7 180 top
LED1  XL-4008UGC  [LED-SMD_L4.0-W1.4-FD_my]  20.7 3 160 top
LED2  XL-4008SURC  [LED-SMD_L4.0-W1.4-RD_GREEN]  37.4 3 20 top
Q2  -  [SOT-363_L2.0-W1.3-P0.65-LS2.1-BR]  34.45 16.95 270 top
Q3  -  [SOT-23-3_L2.9-W1.6-P1.90-LS2.8-BR]  44.7 24.7 180 top
Q9  -  [SOT-23-3_L2.9-W1.6-P1.90-LS2.8-BR]  44.7 28.7 180 top
Q10  SS8050  [SOT-23-3_L2.9-W1.6-P1.90-LS2.8-BR]  44.37 36.2 180 top
R1  10kΩ  [R0603]  34.2 25.95 0 top
R3  10kΩ  [R0603]  10.76 34.43 270 top
R4  5.1kΩ  [R0603]  25.11 9.8 270 top
R5  5.1kΩ  [R0603]  23.61 9.8 270 top
R6  1MΩ  [R0603]  36.79 10.5 0 top
R7  10kΩ  [R0603]  36.7 16.95 270 top
R8  10kΩ  [R0603]  38.2 16.95 270 top
R9  470Ω  [R0603]  34.2 32 0 top
R10  470Ω  [R0603]  34.2 33.75 0 top
R11  100Ω  [R0603]  27.7 49.15 90 top
R12  10kΩ  [R0603]  35.4 49.3 0 top
R20  10kΩ  [R0603]  41.01 25.65 0 top
R26  1kΩ  [R0603]  41.01 27.75 0 top
R31  10kΩ  [R0603]  41.01 29.65 0 top
R32  10kΩ  [R0603]  41.01 23.75 0 top
R33  51Ω  [R0603]  45.19 18.5 180 top
R34  51Ω  [R0603]  45.19 20.9 180 top
R35  10kΩ  [R0603]  25.65 25.1 0 top
R37  22Ω  [R0603]  49.01 30.6 0 top
R38  22Ω  [R0603]  48.25 36.8 90 top
R39  22Ω  [R0603]  47.5 33.6 180 top
R41  1kΩ  [R0603]  39.97 36.2 90 top
R44  10kΩ  [R0603]  20.11 5.7 180 top
R45  10kΩ  [R0603]  36.74 4.8 180 top
R46  10kΩ  [R0603]  41.57 36.2 90 top
U2  -  [SOT-23-5_L3.0-W1.7-P0.95-LS2.8-BR]  13.83 18.02 180 top
U11  SFH 4253-Z  [SOIC-16_L9.9-W3.9-P1.27-LS6.0-BL]  27.45 17.45 270 top
U12  SFH 4253-Z  [LED-SMD_EVERLIGHT_LKIR30102C-A01XY]  15.7 52.6 30 top
U13  SFH 4253-Z  [LED-SMD_EVERLIGHT_LKIR30102C-A01XY]  2.2 29.2 90 top
U14  LKIR30102C-A01(XY)  [LED-SMD_EVERLIGHT_LKIR30102C-A01XY]  15.7 5.8 150 top
U15  LKIR30102C-A01(XY)  [LED-SMD_EVERLIGHT_LKIR30102C-A01XY]  42.7 5.9 210 top
U16  LKIR30102C-A01(XY)  [LED-SMD_EVERLIGHT_LKIR30102C-A01XY]  56.2 29.2 270 top
U17  LKIR30102C-A01(XY)  [LED-SMD_EVERLIGHT_LKIR30102C-A01XY]  42.7 52.6 330 top
U18  ESP32-C6-MINI-1-N4  [WIFIM-SMD_61P-L16.6-W13.2-P0.80-ESP32-C6-MINI-1-N4]  23.2 32.5 0 top
U19  SFH 4253-Z  [OPTO-SMD_L3.2-W2.8-LS3.5-L-1]  5.2 29.2 270 top
U20  SFH 4253-Z  [OPTO-SMD_L3.2-W2.8-LS3.5-L-1]  19.3 9.6 330 top
U21  SFH 4253-Z  [OPTO-SMD_L3.2-W2.8-LS3.5-L-1]  53.2 29.2 270 top
U22  SFH 4253-Z  [OPTO-SMD_L3.2-W2.8-LS3.5-L-1]  42.9 10 210 top
U23  SFH 4253-Z  [OPTO-SMD_L3.2-W2.8-LS3.5-L-1]  42.2 49.2 150 top
U24  SFH 4253-Z  [OPTO-SMD_L3.2-W2.8-LS3.5-L-1]  16.2 49.2 30 top
USBC1  -  [USB-C_SMD-TYPE-C-31-M-12]  29.2 4 0 top
X1  12MHz  [OSC-SMD_4P-L3.2-W2.5-BL]  20.45 16.2 0 top

## Footprints (pads in the part's own frame, mm; a bottom-side part is the same pattern mirrored in y, then rotated)
C0603
  rect 0.8x0.9 smd: 1(-0.7,0) 2(0.7,0)
LED-SMD_EVERLIGHT_LKIR30102C-A01XY
  rect 1x1.6 smd: 1(1.5,0.2) 2(-1.5,0.2)
  rect 0.9x0.6 smd: 3(0,-0.2)
LED-SMD_L4.0-W1.4-FD_my
  rect 1.6x1.1 smd: 1(-1.85,0) 2(1.85,0)
LED-SMD_L4.0-W1.4-RD_GREEN
  rect 1.6x1.1 smd: 1(-1.85,0) 2(1.85,0)
OPTO-SMD_L3.2-W2.8-LS3.5-L-1
  rect 1.6x2.3 smd: 1(-1.397,0) 2(1.397,0)
OPTO-TH_IRM-56384
  rect 1.5x1.5 hole 0.9: 1(-2.54,0)
  round 1.5 hole 0.9: 2(0,0) 3(2.54,0)
OSC-SMD_4P-L3.2-W2.5-BL
  rect 1.4x1.2 smd: 1(-1.1,-0.875) 2(1.1,-0.875) 3(1.1,0.875) 4(-1.1,0.875)
R0603
  rect 0.806x0.864 smd: 1(-0.753,0) 2(0.753,0)
SOD-123_L2.7-W1.6-LS3.7-RD
  rect 0.91x1.22 smd: 1(-1.635,0) 2(1.635,0)
SOD-523_L1.2-W0.8-LS1.6-BI
  rect 0.6x0.6 smd: 1(-0.75,0) 2(0.75,0)
SOIC-16_L9.9-W3.9-P1.27-LS6.0-BL
  oval 0.602x1.971 smd: 1(-4.445,-2.736) 2(-3.175,-2.736) 3(-1.905,-2.736) 4(-0.635,-2.736) 5(0.635,-2.736) 6(1.905,-2.736) 7(3.175,-2.736) 8(4.445,-2.736) 9(4.445,2.736) 10(3.175,2.736) 11(1.905,2.736) 12(0.635,2.736) 13(-0.635,2.736) 14(-1.905,2.736) 15(-3.175,2.736) 16(-4.445,2.736)
SOT-23-3_L2.9-W1.6-P1.90-LS2.8-BR
  rect 1.07x0.6 smd: 1(1.235,-0.95) 2(1.235,0.95) 3(-1.235,0)
SOT-23-5_L3.0-W1.7-P0.95-LS2.8-BR
  rect 1x0.6 smd: 1(1.3,-0.95) 2(1.3,0) 3(1.3,0.95) 4(-1.3,0.95) 5(-1.3,-0.95)
SOT-363_L2.0-W1.3-P0.65-LS2.1-BR
  rect 0.9x0.4 smd: 1(0.9,-0.65) 2(0.9,0) 3(0.9,0.65) 4(-0.9,0.65) 5(-0.9,0) 6(-0.9,-0.65)
USB-C_SMD-TYPE-C-31-M-12
  oval 1.2x2 hole 0.8x1.6: 0(-4.325,1.716) 0(4.325,1.716)
  oval 1.2x1.8 hole 0.8x1.4: 0(-4.325,-2.484) 0(4.325,-2.484)
  rect 0.3x1.3 smd: A1(-3.35,2.484) A4(-2.55,2.484) A5(-1.25,2.484) A6(-0.25,2.484) A7(0.25,2.484) A8(1.25,2.484) A9(2.55,2.484) A12(3.35,2.484) B1(3.05,2.484) B4(2.25,2.484) B5(1.75,2.484) B6(0.75,2.484) B7(-0.75,2.484) B8(-1.75,2.484) B9(-2.25,2.484) B12(-3.05,2.484)
WIFIM-SMD_61P-L16.6-W13.2-P0.80-ESP32-C6-MINI-1-N4
  rect 0.8x0.4 smd: 1(-5.9,3.975) 2(-5.9,3.175) 3(-5.9,2.375) 4(-5.9,1.575) 5(-5.9,0.775) 6(-5.9,-0.025) 7(-5.9,-0.825) 8(-5.9,-1.625) 9(-5.9,-2.425) 10(-5.9,-3.225) 11(-5.9,-4.025) 25(5.9,-4.025) 26(5.9,-3.225) 27(5.9,-2.425) 28(5.9,-1.625) 29(5.9,-0.825) 30(5.9,-0.025) 31(5.9,0.775) 32(5.9,1.575) 33(5.9,2.375) 34(5.9,3.175) 35(5.9,3.975)
  rect 0.4x0.8 smd: 12(-4.8,-4.9) 13(-4,-4.9) 14(-3.2,-4.9) 15(-2.4,-4.9) 16(-1.6,-4.9) 17(-0.8,-4.9) 18(0,-4.9) 19(0.8,-4.9) 20(1.6,-4.9) 21(2.4,-4.9) 22(3.2,-4.9) 23(4,-4.9) 24(4.8,-4.9) 36(4.8,4.9) 37(4,4.9) 38(3.2,4.9) 39(2.4,4.9) 40(1.6,4.9) 41(0.8,4.9) 42(0,4.9) 43(-0.8,4.9) 44(-1.6,4.9) 45(-2.4,4.9) 46(-3.2,4.9) 47(-4,4.9) 48(-4.8,4.9)
  rect 1.45x1.45 smd: 49(-1.775,1.85) 49(-1.775,0.05) 49(-1.775,-1.75) 49(0.025,1.85) 49(0.025,0.05) 49(0.025,-1.75) 49(1.825,1.85) 49(1.825,0.05) 49(1.825,-1.75)
  rect 0.7x0.7 smd: 50(5.95,4.95) 51(5.95,-4.95) 52(-5.95,-4.95) 53(-5.95,4.95)

## Nets
GND: C1.2 C2.1 C3.2 C4.2 C5.1 C6.1 C7.2 C8.1 C9.2 C10.2 C11.1 C12.1 C13.1 C14.2 C18.1 C19.1 D1.2 D2.2 D3.2 IR1.2 Q3.2 Q9.2 Q10.2 R4.1 R5.1 R6.2 R31.1 R32.1 R44.1 R46.1 U2.2 U11.1 U18.1 U18.2 U18.11 U18.14 U18.36 U18.37 U18.38 U18.39 U18.40 U18.41 U18.42 U18.43 U18.44 U18.45 U18.46 U18.47 U18.48 U18.49 U18.50 U18.51 U18.52 U18.53 USBC1.A1 USBC1.A12 USBC1.B1 USBC1.B12 X1.2 X1.4
VDD_5V: C6.2 C8.2 D4.1 U2.1 U2.3 U12.1 U15.1 U20.2 U22.2 U24.2
VDD_ESP32: C1.1 C2.2 C10.1 C11.2 C12.2 LED1.1 LED2.2 R1.2 R3.1 R11.1 R12.1 R35.1 U2.5 U11.16 U18.3
CC1: R4.2 USBC1.A5
CC2: R5.2 USBC1.B5
DTR: Q2.1 R8.2 U11.13
ESP_EN: C3.1 C4.1 Q2.3 R3.2 U18.8
ESP_IO9: Q2.6 R1.1 U18.23
ESP_RX0: R9.1 U18.30
ESP_TX0: R10.1 U18.31
GPIO_LED_SATUS: R41.1 U18.29
RTS: Q2.4 R7.1 U11.14
RX_IR: IR1.1 R12.2 U18.10
SHIELD: C5.2 C7.1 R6.1 USBC1.0
TX_IR: R20.1 R26.1 U18.9
USBDN: D2.1 U11.6 USBC1.A7 USBC1.B7
USBDP: D3.1 U11.5 USBC1.A6 USBC1.B6
VUSB: D1.1 D4.2 USBC1.A4 USBC1.A9 USBC1.B4 USBC1.B9
X0: C18.2 U11.8 X1.1
X1: C19.2 U11.7 X1.3
$1N8418: Q2.2 R7.2
$1N8579: Q2.5 R8.1
$1N9802: C9.1 U2.4
$1N25941: C13.2 U11.4
$1N27717: C14.1 IR1.3 R11.2
$1N35621: R9.2 U11.2
$1N35623: R10.2 U11.3
$1N37592: Q3.1 R20.2 R32.2
$1N42833: Q9.1 R26.2 R31.2
$1N46226: Q3.3 R33.1 R34.1
$1N46382: Q9.3 R37.1 R38.1 R39.1
$1N46399: U16.2 U17.1
$1N46407: R34.2 U17.2
$1N46409: U15.2 U16.1
$1N46420: U13.2 U14.1
$1N46422: R33.2 U14.2
$1N46424: U12.2 U13.1
$1N61816: R35.2 U18.22
$1N61932: U19.2 U20.1
$1N62062: U21.2 U22.1
$1N62136: U23.2 U24.1
$1N62310: R37.2 U21.1
$1N62317: R38.2 U23.1
$1N64118: R39.2 U19.1
$1N66097: Q10.1 R41.2 R46.2
$1N66164: LED1.2 R44.2
$1N66203: Q10.3 R45.1
$1N66205: LED2.1 R45.2

Pads without a net: U11 9 10 11 12 15; U12 3; U13 3; U14 3; U15 3; U16 3; U17 3; U18 4 5 6 7 12 13 15 16 17 18 19 20 21 24 25 26 27 28 32 33 34 35; USBC1 A8 B8

## Via types
v1: diameter 0.61, hole 0.305, Top Layer to Bottom Layer, 106 vias

## Routing (per net, layer and track width the routed paths; a pad name or vN(x,y) marks a point on that pad's centre or on a via; arc(x,y) is an arc through that point)
GND: length 9.2
  Top Layer w0.254: U18.49 U18.49 ; U18.49 U18.49 ; U18.49 U18.49 ; U18.49 U18.49 ; U11.1 24.71,21.9 C13.1
  vias: v1(4.55,34.65) v1(5.3,34.65) v1(5.8,38) v1(5.8,37.2) v1(5.8,36.5) v1(5.8,35.7) v1(6.05,34.65) v1(7.3,34.15) v1(7.9,13.95) v1(8.65,13.95) v1(9.4,13.95) v1(10.51,23.6) v1(11.2,23.6) v1(11.4,40.85) v1(11.4,39.85) v1(11.8,41.7) v1(12.36,40.85) v1(12.36,39.85) v1(13.11,40.35) v1(18.03,24.5) v1(18.78,24.5) v1(19.2,22.2) v1(19.55,36) v1(19.51,34.5) v1(19.51,33.5) v1(19.51,32.5) v1(19.51,31.38) v1(20.2,22.2) v1(20.55,36) v1(21.11,4.4) v1(21.23,22.2) v1(21.55,36) v1(21.58,13.95) v1(21.61,11.9) v1(21.9,4.4) v1(22.33,26) v1(22.33,13.95) v1(22.4,11.9) v1(22.67,36) v1(23.08,26) v1(23.74,36) v1(24.74,36) v1(25.74,36) v1(25.8,11.9) v1(26.86,36) v1(26.9,33.7) v1(26.9,32.7) v1(26.9,31.7) v1(26.9,30.58) v1(27.7,18) v1(30.95,12) v1(31.7,12) v1(32.01,23.3) v1(34.6,24.66) v1(35.02,36.6) v1(35.57,24.66) v1(35.99,36.6) v1(36.61,12.4) v1(36.61,11.7) v1(37.3,11.7) v1(38.01,21.5) v1(38.98,21.5) v1(40.62,30.88) v1(40.8,33.89) v1(40.8,32.91) v1(41.59,30.88)
VDD_5V: length 111.4
  Top Layer w0.5: v1(10.4,46.8) 8.4,44.8 8.4,28.5 12.53,24.37 C8.2 U2.1 11.23,18.97 10.7,18.45 10.7,16.45 ; 10.7,16.45 C6.2 D4.1 v1(14.51,13.04) 15.4,12.14 15.4,8.6 16.61,7.4 19.7,7.4 20.51,8.21 U20.2 ; 10.7,16.45 11.33,17.07 U2.3 ; U12.1 17.08,53.7 v1(18.61,53.7) 18.61,51.09 U24.2 ; U15.1 41.01,5.48 41.01,7.24 41.7,7.94 U22.2 38.4,12.59 v1(38.4,12.6)
  Bottom Layer w0.254: v1(14.51,13.04) 14.51,13.1
  Bottom Layer w0.5: v1(10.4,46.8) 13.4,49.8 18.2,49.8 19.4,51 19.4,52.9 v1(18.61,53.7) ; v1(38.4,12.6) 37.3,13.7 31.51,13.7 28.11,10.3 17.24,10.3 v1(14.51,13.04)
VDD_ESP32: length 138.1
  Top Layer w0.4: U18.3 16.13,34.88 15.82,35.19 C1.1
  Top Layer w0.5: 24.9,23.2 24.9,23.2 24.9,25.1 ; 24.9,23.2 18.95,23.2 18.2,22.45 15.14,22.45 15.13,22.44 ; 24.9,23.2 27.45,23.2 28.76,21.9 U11.16 C12.2 C11.2 v1(36.15,21.9) 37.2,22.95 37.2,25.45 36.7,25.95 R1.2 ; 15.13,22.44 15.13,23.37 9.51,29 9.51,35.19 ; 15.13,22.44 U2.5 ; R12.1 34.65,47.9 32.45,45.7 27.7,45.7 ; 9.51,35.19 9.51,42.5 12.7,45.7 27.7,45.7 ; 9.51,35.19 R3.1 C1.1 ; 27.7,45.7 R11.1
  Top Layer w0.508: v1(39.51,8.3) 39.51,4 LED2.2 ; 23.18,3.1 v1(23.2,3.1) 22.47,2.37 LED1.1
  Bottom Layer w0.508: v1(23.2,3.1) 23.61,3.5 34.7,3.5 v1(39.51,8.3) 39.51,11.8 41.2,13.5 41.2,19.4 40.2,20.4 37.06,20.4 36.15,21.31 v1(36.15,21.9)
CC1: length 11.5
  Top Layer w0.254: 27.95,6.39 27.95,4.95 26.95,3.95 24.36,3.95 23.61,4.7 23.61,6.5 25.11,8 R4.2
CC2: length 14.7
  Top Layer w0.254: 30.95,6.39 30.95,5.15 29.35,3.54 24.19,3.54 23.2,4.53 23.2,7.29 23.61,7.7 R5.2
DTR: length 13.8
  Top Layer w0.254: 33.45,14.7 34.2,13.95 36.95,13.95 38.2,15.2 R8.2 ; 33.45,14.7 32.7,14.7 32.2,15.2 32.2,17.2 31.32,18.09 30.33,18.09 ; 33.45,14.7 33.8,15.05 Q2.1
ESP_EN: length 41.3
  Top Layer w0.254: v1(35.7,15.2) 35.2,15.2 35.11,15.3 Q2.3
  Top Layer w0.3: U18.8 15.7,30.88
  Top Layer w0.5: R3.2 11.78,33.68 12.04,33.42 C3.1 C4.1 15.29,33.42 15.7,33 15.7,26.7 v1(16.7,25.7)
  Bottom Layer w0.5: v1(16.7,25.7) 19.3,25.7 24.61,20.4 24.61,16.9 26.3,15.2 v1(35.7,15.2)
ESP_IO9: length 16.5
  Top Layer w0.254: U18.23 27.2,26.6 27.86,25.95 R1.1 ; Q2.6 33.8,18.35 33.45,18.7 v1(32.95,18.7)
  Top Layer w0.5: v1(33.45,24.55) R1.1
  Bottom Layer w0.5: v1(33.45,24.55) 32.95,24.05 v1(32.95,18.7)
ESP_RX0: length 4.5
  Top Layer w0.254: 29.11,32.48 32.13,32.48 32.61,32 R9.1
ESP_TX0: length 4.5
  Top Layer w0.254: R10.1 32.55,33.75 32.08,33.28 U18.31
GPIO_LED_SATUS: length 14.6
  Top Layer w0.254: R41.1 39.97,33.97 36.11,30.1 32.4,30.1 30.83,31.68 U18.29
RTS: length 9.7
  Top Layer w0.254: Q2.4 35.11,19.05
  Top Layer w0.5: 30.33,19.36 31.86,19.36 32.7,20.2 34.2,20.2 35.11,19.3 35.11,19.05 36.36,19.05 36.7,18.7 R7.1
RX_IR: length 46.3
  Top Layer w0.254: U18.10 v1(18.3,29.28)
  Top Layer w0.5: v1(36.9,46.6) 36.16,47.35 R12.2 37.11,49.3 37.99,50.19 IR1.1
  Bottom Layer w0.5: v1(36.9,46.6) 39.9,46.6 40.8,45.7 40.8,37.1 38.4,34.7 24.9,34.7 19.48,29.28 v1(18.3,29.28)
SHIELD: length 6.8
  Top Layer w0.508: USBC1.0 34.32,5.72 35.2,6.6 C5.2 C7.1 R6.1
TX_IR: length 26.4
  Top Layer w0.254: v1(21.51,28.9) 19.9,28.9 18.73,30.08 U18.9
  Top Layer w0.5: v1(30.61,28.5) 31.8,27.3 38.4,27.3 39.01,26.7 40.25,26.7 ; 40.25,26.7 R20.1 ; 40.25,26.7 R26.1
  Bottom Layer w0.5: v1(21.51,28.9) 30.2,28.9 v1(30.61,28.5)
USBDN: length 14.9
  Top Layer w0.297: 29.45,5.89 29.45,5.47 29.2,5.22 28.7,5.22 28.45,5.47 28.45,6.14 ; 28.45,6.39 28.45,7.18 28.48,7.21 28.48,11.54 27.7,12.32 27.7,15.2 26.95,15.96 25.86,15.96 25.45,15.55 U11.6
USBDP: length 15.3
  Top Layer w0.297: 29.95,6.39 29.95,7.21 29.66,7.5 28.93,7.5 ; U11.5 25.49,16.82 25.9,16.41 27.14,16.41 28.15,15.39 28.15,12.5 28.93,11.73 28.93,7.5 ; 28.93,7.5 28.93,7.21 28.95,7.18 28.95,6.39
VUSB: length 36.8
  Top Layer w0.254: 32.45,10.2 32.45,9.7 32.12,9.37 ; 31.45,6.39 31.45,8.95 31.87,9.37 32.12,9.37 ; 26.95,6.39 26.95,8.95 26.7,9.2 v1(26.65,9.15) 26.65,6.39 ; 32.12,9.37 31.76,9 31.76,6.39
  Top Layer w0.5: v1(32.45,11.45) 32.45,10.2 ; v1(14.01,8.1) 13.4,8.1 12.95,8.55 D4.2
  Bottom Layer w0.5: v1(32.45,11.45) 30.15,9.15 v1(26.65,9.15) 15.05,9.15 v1(14.01,8.1)
X0: length 9.4
  Top Layer w0.5: C18.2 X1.1 19.36,14.12 20.47,13.01 U11.8
X1: length 8.1
  Top Layer w0.5: C19.2 21.2,18.95 21.7,18.45 21.7,17.23 X1.3 22.58,17.08 23.2,16.45 23.2,14.95 23.88,14.28 U11.7
$1N8418: length 5.2
  Top Layer w0.254: Q2.2 34.45,14.7 34.7,14.45 36.2,14.45 36.7,14.95 R7.2
$1N8579: length 9.9
  Top Layer w0.254: Q2.5 34.45,18.7 v1(33.95,19.2)
  Top Layer w0.5: v1(39.7,19.2) 39.7,18.45 38.96,17.7 R8.1
  Bottom Layer w0.5: v1(33.95,19.2) v1(39.7,19.2)
$1N9802: length 2.9
  Top Layer w0.5: C9.1 14.7,15.2 15.13,15.63 U2.4
$1N25941: length 4
  Top Layer w0.5: C13.2 22.7,18.8 23.42,18.09 U11.4
$1N27717: length 6
  Top Layer w0.5: 27.7,49.9 C14.1 31.12,49.9 IR1.3
$1N35621: length 16.5
  Top Layer w0.5: U11.2 26.13,20.63 v1(26.95,21.45) ; R9.2 35.01,31.95 v1(35.01,30.9)
  Bottom Layer w0.5: v1(35.01,30.9) 35.01,29.5 v1(26.95,21.45)
$1N35623: length 21.4
  Top Layer w0.5: R10.2 35.7,33.75 v1(36.45,33) ; v1(27.2,19.95) 26.61,19.36 U11.3
  Bottom Layer w0.5: v1(36.45,33) 36.45,29.2 v1(27.2,19.95)
$1N37592: length 3.6
  Top Layer w0.5: Q3.1 R20.2 R32.2
$1N42833: length 3.6
  Top Layer w0.5: Q9.1 R31.2 R26.2
$1N46226: length 6.2
  Top Layer w0.5: R33.1 R34.1 Q3.3
$1N46382: length 8.9
  Top Layer w0.5: R38.1 R37.1 48.25,29.95 47.01,28.7 Q9.3
$1N46407: length 37.4
  Top Layer w0.5: U17.2 41.13,53.9 v1(40.11,53.9) ; R34.2 v1(42.8,20.9)
  Bottom Layer w0.5: v1(40.11,53.9) 40.01,53.8 40.01,52.7 42.8,49.9 v1(42.8,20.9)
$1N46409: length 26.8
  Top Layer w0.5: v1(48.31,9.29) arc(46.4,7.61) 44.34,6.12 ; v1(56.4,26.5) U16.1
  Bottom Layer w0.5: v1(48.31,9.29) 48.31,18.41 v1(56.4,26.5)
$1N46420: length 27.8
  Top Layer w0.5: 14.31,6.39 arc(12.84,7.42) v1(11.45,8.54) ; v1(2,25.8) U13.2
  Bottom Layer w0.5: v1(11.45,8.54) 11.45,17.06 7.11,21.4 5.2,21.4 2,24.6 v1(2,25.8)
$1N46422: length 35.4
  Top Layer w0.5: v1(17.2,6.4) 17.2,5.18 U14.2 ; v1(33.2,8) 34.9,9.7 34.9,12.2 35.9,13.2 37.4,13.2 42.7,18.5 R33.2
  Bottom Layer w0.5: v1(17.2,6.4) 18.8,8 v1(33.2,8)
$1N61816: length 2.5
  Top Layer w0.254: U18.22 R35.2
$1N61932: length 22.8
  Top Layer w0.5: v1(16.61,13.5) 17.2,12.9 17.2,11.19 U20.1 ; v1(5.2,25.5) U19.2
  Bottom Layer w0.5: v1(5.2,25.5) 5.2,24.9 v1(16.61,13.5)
$1N62062: length 20.9
  Top Layer w0.5: U21.2 53.2,25.1 47.7,19.6 47.7,14.29 U22.1
$1N62136: length 28.7
  Top Layer w0.254: U23.2 40.4,49.31 40.4,48.6 39.7,47.9 v1(38.3,47.9)
  Top Layer w0.5: U24.1 14.99,47.51 15.3,47.2 v1(18.8,47.2)
  Bottom Layer w0.5: v1(38.3,47.9) 19.5,47.9 18.8,47.2
$1N62310: length 3.4
  Top Layer w0.5: R37.2 53.2,30.6 U21.1
$1N62317: length 13
  Top Layer w0.5: U23.1 48.25,43.67 R38.2
$1N64118: length 45.8
  Top Layer w0.5: U19.1 5.31,30.7 v1(7.51,30.7) ; R39.2 46.2,33.6 44.3,31.7 39.2,31.7 36.01,28.5 v1(32.11,28.5)
  Bottom Layer w0.5: v1(32.11,28.5) 30.61,27 11.2,27 v1(7.51,30.7)
$1N66097: length 3.2
  Top Layer w0.508: Q10.1 42.51,37.15 42.31,36.95 R46.2 R41.2
$1N66164: length 2.2
  Top Layer w0.508: R44.2 18.97,5.32 LED1.2
$1N66203: length 36.5
  Top Layer w0.508: Q10.3 46.3,36.2 v1(46.61,35.9) ; v1(38.4,4.8) R45.1
  Bottom Layer w0.508: v1(38.4,4.8) 42.4,8.8 42.4,9.7 46.61,13.9 v1(46.61,35.9)
$1N66205: length 2.6
  Top Layer w0.508: LED2.1 35.67,4.48 R45.2
$1N46399: length 25.9
  Top Layer w0.5: 44.29,52.31 arc(53.1,43.01) 56.76,30.73
$1N46424: length 25.6
  Top Layer w0.5: 1.98,30.69 arc(5.59,42.83) 14.29,52.02

## Copper pours and planes (outline as drawn; the poured copper is in the pictures)
GND on Top Layer: outline of 184 points within -1.62,-3.73 64.23,62.13
GND on Bottom Layer: outline of 184 points within -3.72,-3.73 62.13,62.13

## Text on the board
Bottom Silkscreen Layer: Firmware / by Tasmota | DEVELOPED BY ROBONOMICS COMMUNITY | IR REMOTE
Top Silkscreen Layer: ESP32-C6-MINI-1-N4 | IR-ESP32C6-06-24
